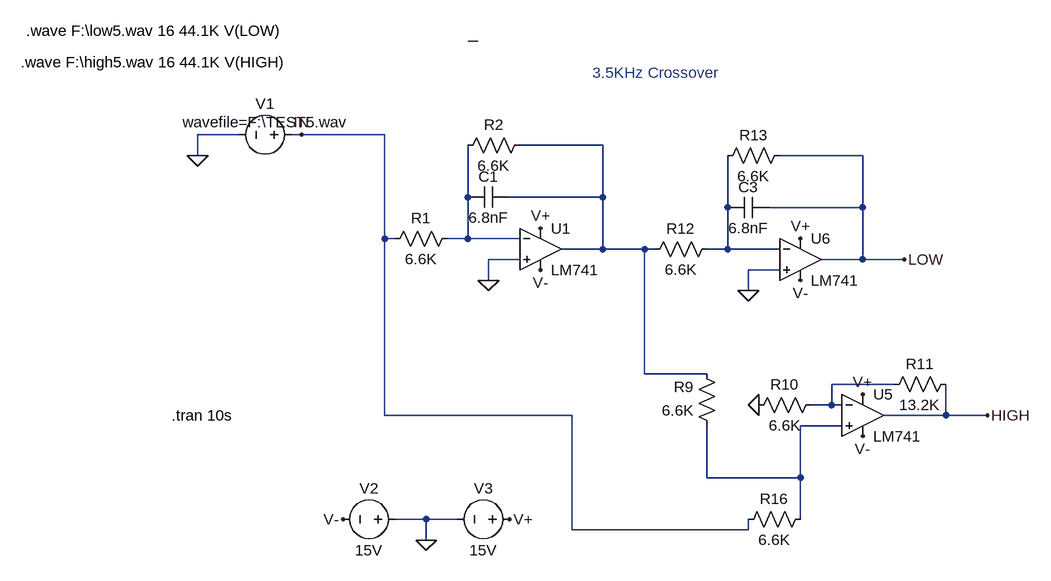
[diagram p0: schematic 2WayActiveCrossover.asc]
2WayActiveCrossover.asc, the LTspice schematic file:
Version 4
SHEET 1 1732 688
WIRE 144 -112 128 -112
WIRE -224 32 -288 32
WIRE -128 32 -144 32
WIRE 0 32 -128 32
WIRE 336 48 208 48
WIRE -288 64 -288 32
WIRE 736 64 608 64
WIRE 128 128 128 48
WIRE 336 128 336 48
WIRE 336 128 192 128
WIRE 528 144 528 64
WIRE 736 144 736 64
WIRE 736 144 592 144
WIRE 0 192 0 32
WIRE 16 192 0 192
WIRE 128 192 128 128
WIRE 128 192 96 192
WIRE 208 192 128 192
WIRE 336 208 336 128
WIRE 336 208 272 208
WIRE 400 208 336 208
WIRE 416 208 400 208
WIRE 528 208 528 144
WIRE 528 208 496 208
WIRE 608 208 528 208
WIRE 208 224 160 224
WIRE 736 224 736 144
WIRE 736 224 672 224
WIRE 800 224 736 224
WIRE 608 240 560 240
WIRE 160 256 160 224
WIRE 560 272 560 240
WIRE 400 400 400 208
WIRE 496 400 400 400
WIRE 784 416 688 416
WIRE 688 448 688 416
WIRE 688 448 656 448
WIRE 704 448 688 448
WIRE 0 464 0 192
WIRE 288 464 0 464
WIRE 864 464 864 416
WIRE 864 464 768 464
WIRE 928 464 864 464
WIRE 704 480 640 480
WIRE 496 560 496 480
WIRE 640 560 640 480
WIRE 640 560 496 560
WIRE 64 624 16 624
WIRE 112 624 64 624
WIRE 640 624 640 560
WIRE 288 640 288 464
WIRE 560 640 560 624
WIRE 560 640 288 640
WIRE 64 656 64 624
FLAG 64 656 0
FLAG 192 624 V+
FLAG -64 624 V-
FLAG 240 240 V-
FLAG 240 176 V+
FLAG 160 256 0
FLAG -288 64 0
FLAG 800 224 LOW
FLAG 928 464 HIGH
FLAG -128 32 IN
FLAG 736 432 V+
FLAG 736 496 V-
FLAG 640 256 V-
FLAG 640 192 V+
FLAG 560 272 0
FLAG 576 448 0
SYMBOL OpAmps\\LM741 240 144 R0
SYMATTR InstName U1
SYMBOL voltage -128 32 R90
WINDOW 0 -32 56 VBottom 2
WINDOW 3 -4 56 VBottom 2
WINDOW 123 0 0 Left 0
WINDOW 39 0 0 Left 0
SYMATTR InstName V1
SYMATTR Value wavefile=F:\TEST5.wav
SYMBOL voltage 32 624 R90
WINDOW 0 -32 56 VBottom 2
WINDOW 3 32 56 VTop 2
WINDOW 123 0 0 Left 0
WINDOW 39 0 0 Left 0
SYMATTR InstName V2
SYMATTR Value 15V
SYMBOL voltage 208 624 R90
WINDOW 0 -32 56 VBottom 2
WINDOW 3 32 56 VTop 2
WINDOW 123 0 0 Left 0
WINDOW 39 0 0 Left 0
SYMATTR InstName V3
SYMATTR Value 15V
SYMBOL res 112 176 R90
WINDOW 0 0 56 VBottom 2
WINDOW 3 32 56 VTop 2
SYMATTR InstName R1
SYMATTR Value 6.6K
SYMBOL res 224 32 R90
WINDOW 0 0 56 VBottom 2
WINDOW 3 32 56 VTop 2
SYMATTR InstName R2
SYMATTR Value 6.6K
SYMBOL cap 192 112 R90
WINDOW 0 0 32 VBottom 2
WINDOW 3 32 32 VTop 2
SYMATTR InstName C1
SYMATTR Value 6.8nF
SYMBOL OpAmps\\LM741 736 400 R0
SYMATTR InstName U5
SYMBOL res 672 432 R90
WINDOW 0 0 56 VBottom 2
WINDOW 3 32 56 VTop 2
SYMATTR InstName R10
SYMATTR Value 6.6K
SYMBOL res 880 400 R90
WINDOW 0 0 56 VBottom 2
WINDOW 3 32 56 VTop 2
SYMATTR InstName R11
SYMATTR Value 13.2K
SYMBOL OpAmps\\LM741 640 160 R0
SYMATTR InstName U6
SYMBOL res 512 192 R90
WINDOW 0 0 56 VBottom 2
WINDOW 3 32 56 VTop 2
SYMATTR InstName R12
SYMATTR Value 6.6K
SYMBOL res 624 48 R90
WINDOW 0 0 56 VBottom 2
WINDOW 3 32 56 VTop 2
SYMATTR InstName R13
SYMATTR Value 6.6K
SYMBOL cap 592 128 R90
WINDOW 0 0 32 VBottom 2
WINDOW 3 32 32 VTop 2
SYMATTR InstName C3
SYMATTR Value 6.8nF
SYMBOL res 656 608 R90
WINDOW 0 0 56 VBottom 2
WINDOW 3 32 56 VTop 2
SYMATTR InstName R16
SYMATTR Value 6.6K
SYMBOL res 512 496 R180
WINDOW 0 36 76 Left 2
WINDOW 3 36 40 Left 2
SYMATTR InstName R9
SYMATTR Value 6.6K
TEXT 320 -64 Left 2 ;3.5KHz Crossover
TEXT -328 464 Left 2 !.tran 10s
TEXT -560 -80 Left 2 !.wave F:\\high5.wav 16 44.1K V(HIGH)
TEXT -552 -128 Left 2 !.wave F:\\low5.wav 16 44.1K V(LOW)

The netlist it stands for:
* 2WayActiveCrossover.asc
XU1 0 N003 V+ V- N002 LM741  ; pins In+ In- V+ V- OUT
V1 IN 0 wavefile=F:\TEST5.wav
V2 0 V- 15V
V3 V+ 0 15V
R1 N003 IN 6.6K
R2 N002 N003 6.6K
C1 N002 N003 6.8nF
XU5 N006 N005 V+ V- HIGH LM741  ; pins In+ In- V+ V- OUT
R10 N005 0 6.6K
R11 HIGH N005 13.2K
XU6 0 N004 V+ V- LOW LM741  ; pins In+ In- V+ V- OUT
R12 N004 N002 6.6K
R13 LOW N004 6.6K
C3 LOW N004 6.8nF
R16 N006 IN 6.6K
R9 N006 N002 6.6K
* 3.5KHz Crossover
.tran 10s
.wave F:\high5.wav 16 44.1K V(HIGH)
.wave F:\low5.wav 16 44.1K V(LOW)
.lib LM741.lib
.backanno
.end